# EAGLE design mailbox (EAGLE 7.5.0)
CNAME: MiniElektro Denmark; CREVISION: 0 #1616; DESIGNER: By: NWYKE
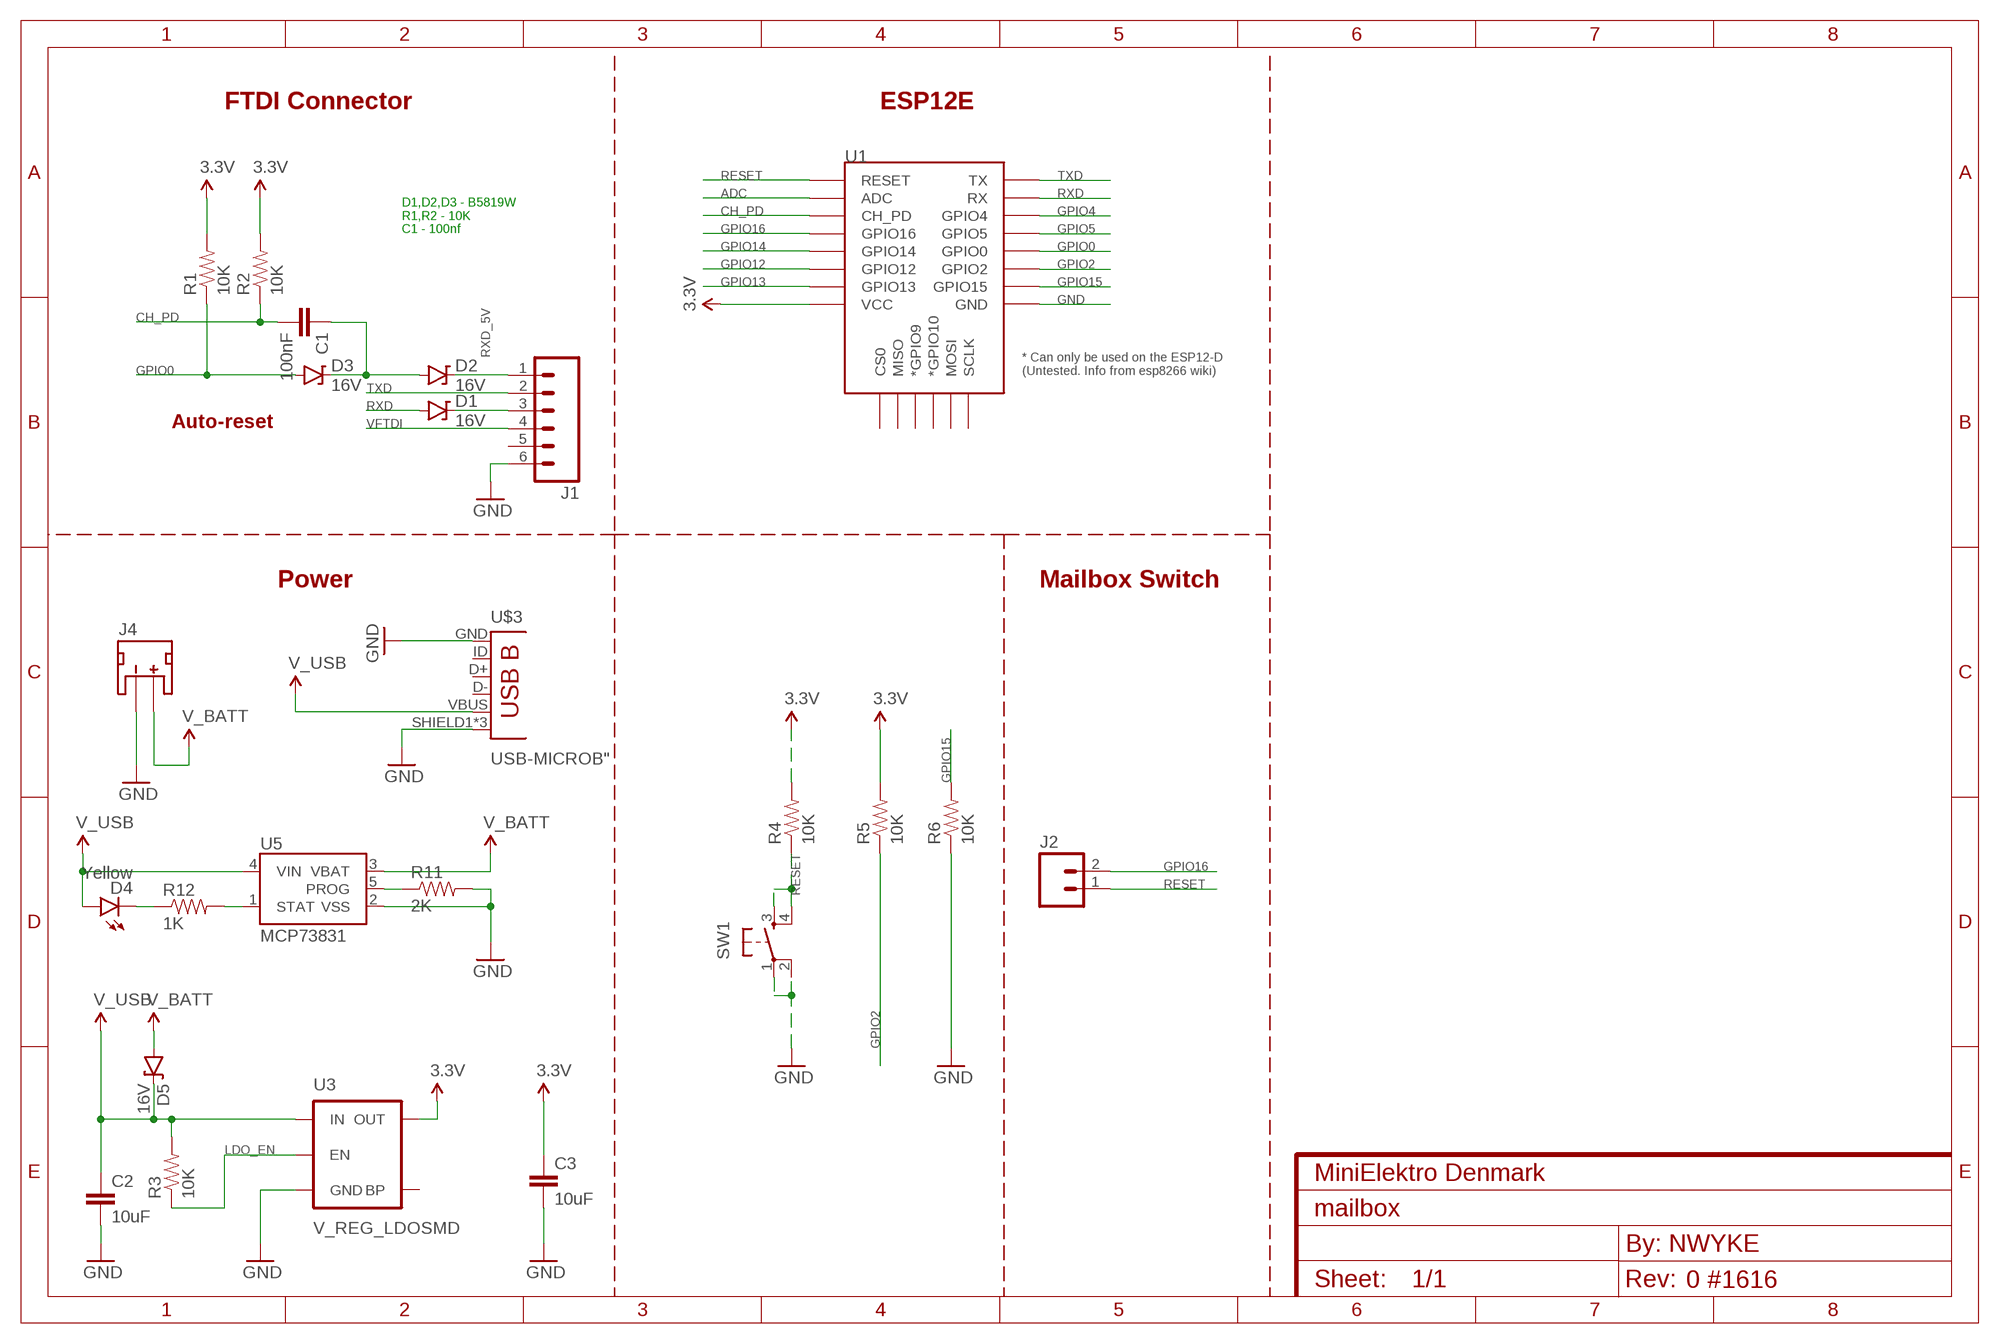
[diagram p0: schematic, sheet 1]

## Parts
C1  100nF  CAP0402-CAP  [0402-CAP]
C2  10uF  CAP0402-CAP  [0402-CAP]
C3  10uF  CAP0402-CAP  [0402-CAP]
D1  16V  DIODE-ZENER16V  [SOD-123]
D2  16V  DIODE-ZENER16V  [SOD-123]
D3  16V  DIODE-ZENER16V  [SOD-123]
D4  Yellow  LED-YELLOW0603  [LED-0603]
D5  16V  DIODE-ZENER16V  [SOD-123]
J1  M06SILK_FEMALE_PTH  [1X06]
J2  M02LOCK  [1X02_LOCK]
J4  JST_2MM_MALE  [JST-2-SMD]
R1  10K  RESISTOR0402-RES  [0402-RES]
R2  10K  RESISTOR0402-RES  [0402-RES]
R3  10K  RESISTOR0402-RES  [0402-RES]
R4  10K  RESISTOR0402-RES  [0402-RES]
R5  10K  RESISTOR0402-RES  [0402-RES]
R6  10K  RESISTOR0402-RES  [0402-RES]
R11  2K  RESISTOR0603-RES  [0603-RES]
R12  1K  RESISTOR0603-RES  [0603-RES]
SW1  SWITCH_SPST_4_PINRECT  [TACTILE_SWITCH_SMD_4.6X2.8MM]
U1  ESP12ESMD  [ESP12E-SMD]
U3  V_REG_LDOSMD  [SOT23-5]
U5  MCP73831  [SOT23-5]
U$3  USB-MICROB"  [USB-B-MICRO-SMD_V03]

## Nets
3.3V: C3.1 R1.2 R2.2 R4.2 R5.2 U1.VCC U3.5(OUT)
ADC: U1.ADC
CH_PD: C1.2 R2.1 U1.CH_PD
GND: C2.2 C3.2 J1.6 J4.1(-) R6.1 R11.2 SW1.1 SW1.2 U1.GND U3.2(GND) U5.2(VSS) U$3.GND U$3.SHIELD1(SHIELD) U$3.SHIELD2(SHIELD) U$3.SHIELD3(SHIELD)
GPIO0: D3.A R1.1 U1.GPIO0
GPIO2: R5.1 U1.GPIO2
GPIO4: U1.GPIO4
GPIO5: U1.GPIO5
GPIO12: U1.GPIO12
GPIO13: U1.GPIO13
GPIO14: U1.GPIO14
GPIO15: R6.2 U1.GPIO15
GPIO16: J2.2 U1.GPIO16
LDO_EN: R3.1 U3.3(EN)
N$1: D4.C R12.1
N$2: D2.C J1.1
N$3: C1.1 D2.A D3.C
N$6: R12.2 U5.1(STAT)
N$7: R11.1 U5.5(PROG)
RESET: J2.1 R4.1 SW1.3 SW1.4 U1.RESET
RXD: D1.A U1.RXD0(RX)
RXD_5V: D1.C J1.3
TXD: J1.2 U1.TXD0(TX)
V_BATT: D5.A J4.2(+) U5.3(VBAT)
V_USB: C2.1 D4.A D5.C R3.2 U3.1(IN) U5.4(VIN) U$3.VBUS
VFTDI: J1.4
Unconnected: J1.5 J4.NC1(PAD1) J4.NC2(PAD2) U1.CS0 U1.GPIO9(*GPIO9) U1.GPIO10(*GPIO10) U1.MISO U1.MOSI U1.SCLK U3.4(BP) U$3.D+ U$3.D- U$3.ID(USBID)

## Notes on the sheet
- FTDI Connector | ESP12E
- D1,D2,D3 - B5819W
  R1,R2 - 10K
  C1 - 100nf
- Auto-reset
- Power | Mailbox Switch

## Library data of the parts
C1-C3 = SparkFun-Passives:CAP: Capacitor Standard 0603 ceramic capacitor, and 0.1" leaded capacitor.
D1-D3 D5 = SparkFun-DiscreteSemi:DIODE-ZENER: Zener Diode Production Part - 8199 3.4V Zener Voltage; PROD_ID: DIO-12440
D4 = SparkFun-LED:LED-YELLOW: Yellow SMD LEDs LilyPad 1206- DIO-09909 0603- DIO-09003 "SMART" means more efficient and expensive; PROD_ID: DIO-09003
J1 = SparkFun-Connectors:M06: Header 6 Standard 6-pin 0.1" header. Use with straight break away headers (SKU : PRT-00116), right angle break away headers (PRT-00553), swiss pins (PRT-00743), machine pins (PRT-00117), and female headers (PRT-00115). Molex polarized connector foot print use with SKU : PRT-08094 with associated crimp pins and housings. NOTES ON THE VARIANTS LOCK and LOCK_LONGPADS... This footprint was designed to help hold the alignment of a through-hole component (i.e. 6-pin header) while soldering it into place. You may notice that each hole has been shifted either up or down by 0.005 of an inch from it's more standard position (which is a perfectly straight line). This slight alteration caused the pins (the squares in the middle) to touch the edges of the holes. Because they are alternating, it causes a "brace" to hold the component in place. 0.005 has proven to be the perfect amount of "off-center" position when using our standard breakaway headers. Although looks a little odd when you look at the bare footprint, once you have a header in there, the alteration is very hard to notice. Also,if you push a header all the way into place, it is covered up entirely on the bottom side. This idea of altering the position of holes to aid alignment will be further integrated into the Sparkfun Library for other footprints. It can help hold any component with 3 or more connection pins.; PROD_ID: CONN-08437
J2 = SparkFun-Connectors:M02: Standard 2-pin 0.1" header. Use with - straight break away headers ( PRT-00116) - right angle break away headers (PRT-00553) - swiss pins (PRT-00743) - machine pins (PRT-00117) - female headers (PRT-00115) Molex polarized connector foot print use with: PRT-08233 with associated crimp pins and housings. 2.54_SCREWTERM for use with PRT-10571. 3.5mm Screw Terminal footprints for PRT-08084 5mm Screw Terminal footprints for use with PRT-08432
J4 = SparkFun-Connectors:JST_2MM_MALE: Mates to single-cell LiPo batteries. CONN-11443 Now with smashable polarity marks!; BTM_NEG: -; BTM_POS: +; PROD_ID: CONN-11443; TOP_NEG: -; TOP_POS: +
R1-R6 R11 R12 = SparkFun-Passives:RESISTOR: Resistor Basic schematic elements and footprints for 0603, 1206, and PTH resistors.
SW1 = SparkFun-Electromechanical:SWITCH_SPST_4_PIN; PROD_ID: SWCH-13065
U1 = esp8266modules:ESP12E: ESP12E Module
U3 = SparkFun-PowerIC:V_REG_LDO: Voltage Regulator LDO Standard 150mA LDO voltage regulator in SOT-23 layout. Micrel part MIC5205. BP (by-pass) pin is used to lower output noise with 470pF cap.
U5 = SparkFun-PowerIC:MCP73831: Miniature single cell, fully integrated Li-Ion, Li-polymer charge management controller http://ww1.microchip.com/downloads/en/DeviceDoc/20001984g.pdf IC-09995; PROD_ID: IC-09995
U$3 = SparkFun-Connectors:USB-MICROB; PROD_ID: CONN-11752

## Board
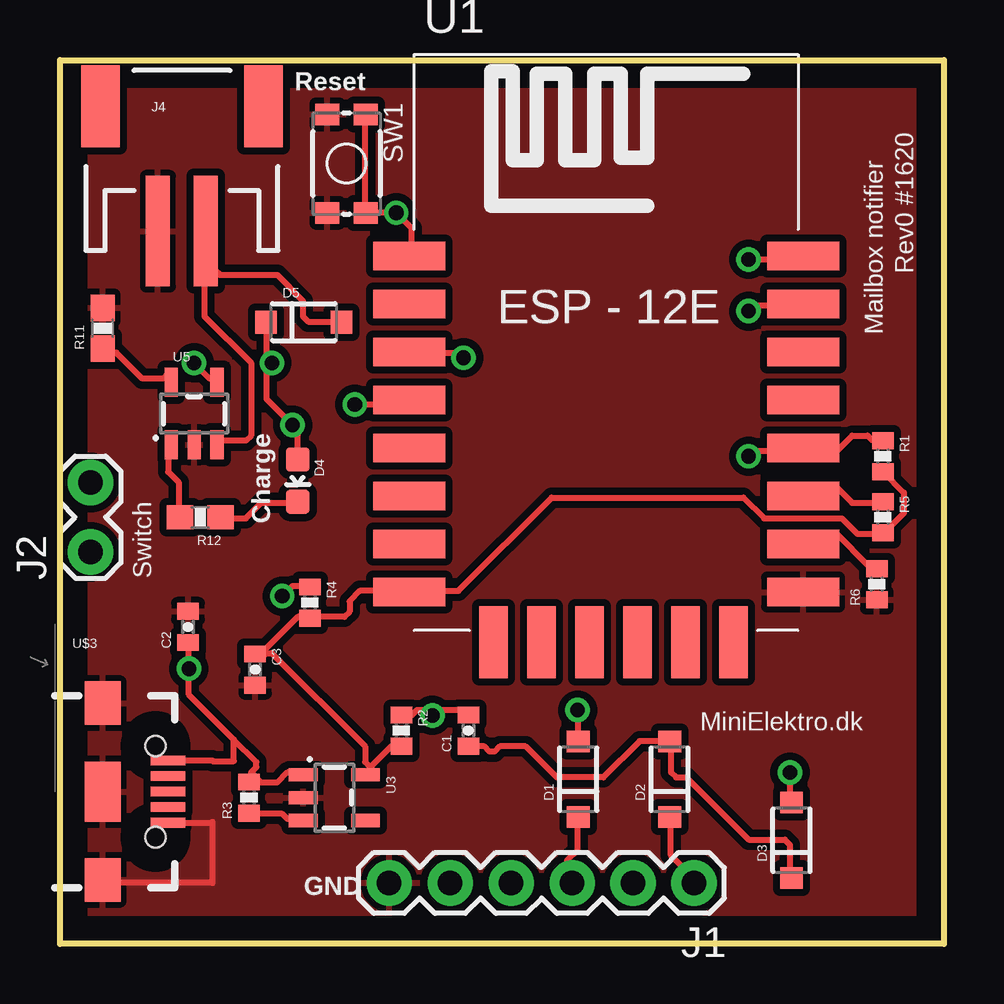
[diagram p1: board, top side]
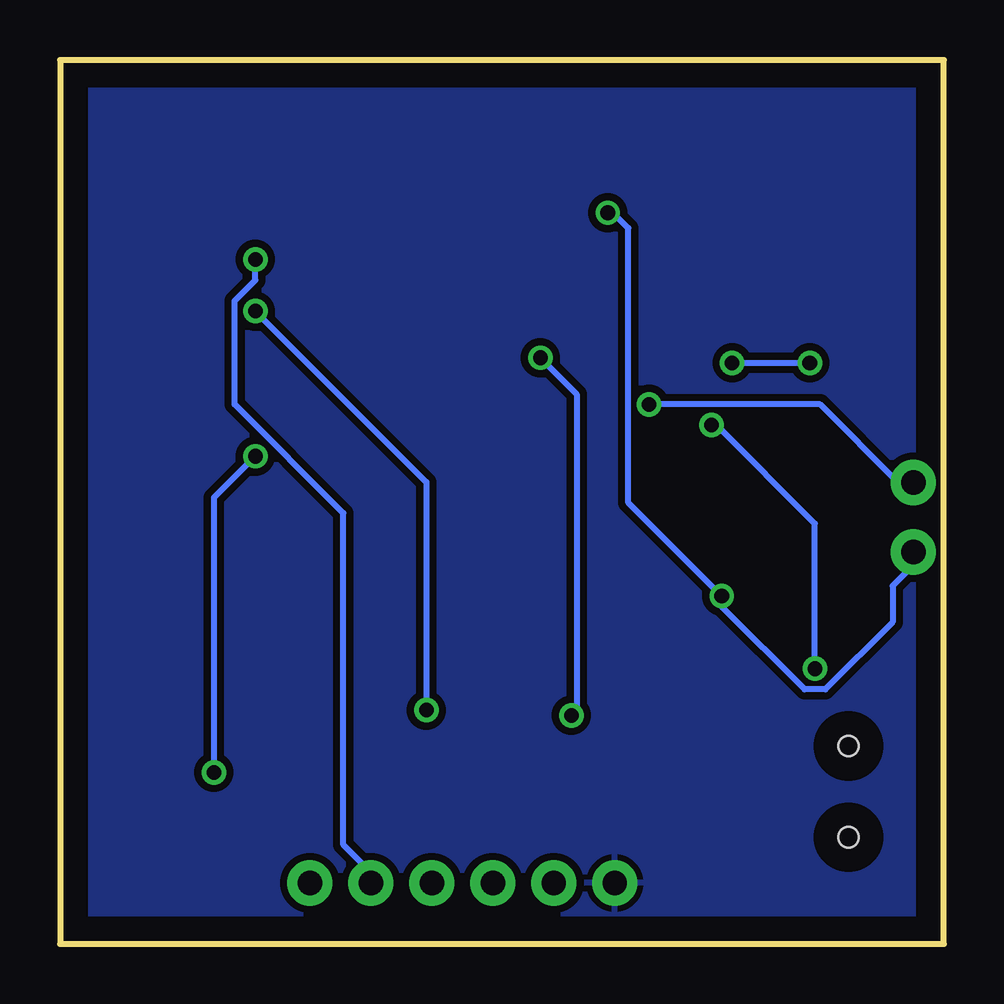
[diagram p2: board, bottom side, seen from below]

Size 36.83 x 36.83 mm. Coordinates in mm from the lower left corner, seen from the top.
Outline: 0,0 0,36.83 36.83,36.83 36.83,0 0,0
Copper layers (1*16): Top 0.035mm / dielectric 1.5mm / Bottom 0.035mm
Design rules "default *": minimum track width 10mil, minimum drill 24mil, track to track 7mil, track to pad 7mil, pad to pad 7mil, via to via 7mil, smd to smd 7mil, copper to edge 40mil, drill to drill 8mil, minimum pad ring 10mil, minimum via ring 8mil, stop-mask expansion 4mil, vias tented up to drill 0mil, thermal gap 10mil

### Footprints (pad centres in the part's own frame; a part is rotated, then mirrored left to right if it is on the bottom)
0402-CAP = smd 0.7 x 0.9: 1 -0.65,0; 2 0.65,0
SOD-123 = smd 0.9 x 0.95: A 1.575,0; C -1.575,0
LED-0603 = smd 1 x 1: A 0,-0.877; C 0,0.877
1X06 = drill 1.016 pad 1.88: 1 0,0; 2 2.54,0; 3 5.08,0; 4 7.62,0; 5 10.16,0; 6 12.7,0
1X02_LOCK = drill 1.016 pad 1.88: 1 -0.178,0; 2 2.718,0
JST-2-SMD = smd 1 x 4.6: 1 -1,-3.7; 2 1,-3.7 | smd 1.6 x 3.4: NC1 -3.4,1.5; NC2 3.4,1.5
0402-RES = smd 0.7 x 0.9: 1 -0.65,0; 2 0.65,0
0603-RES = smd 1.1 x 1: 1 -0.85,0; 2 0.85,0
TACTILE_SWITCH_SMD_4.6X2.8MM = smd 0.9 x 1: 1 -2.05,-0.8; 2 2.05,-0.8; 3 2.05,0.8; 4 -2.05,0.8
ESP12E-SMD = smd 3 x 1.2: ADC -8.3,3.8; CH_PD -8.3,1.8; GND 8.1,-8.2; GPIO0 8.1,-2.2; GPIO2 8.1,-4.2; GPIO4 8.1,1.8; GPIO5 8.1,-0.2; GPIO12 -8.3,-4.2; GPIO13 -8.3,-6.2; GPIO14 -8.3,-2.2; GPIO15 8.1,-6.2; GPIO16 -8.3,-0.2; RESET -8.3,5.8; RXD0 8.1,3.8; TXD0 8.1,5.8; VCC -8.3,-8.2 | smd 1.2 x 3: CS0 -4.8,-10.3; GPIO9 -0.8,-10.3; GPIO10 1.2,-10.3; MISO -2.8,-10.3; MOSI 3.2,-10.3; SCLK 5.2,-10.3
SOT23-5 = smd 0.55 x 1.2: 1 -0.95,-1.3; 2 0,-1.3; 3 0.95,-1.3; 4 0.95,1.3; 5 -0.95,1.3
USB-B-MICRO-SMD_V03 = smd 1.45 x 0.4: D+ 2.725,0; D- 2.725,0.65; GND 2.725,-1.3; ID 2.725,-0.65; VBUS 2.725,1.3 | smd 1.5 x 1.8: SHIELD1 0,3.685; SHIELD2 0,-3.685 | smd 1.5 x 2.5: SHIELD3 0,0 | hole 0.85: 2.2,1.9; 2.2,-1.9

### Placement (x,y rotation side)
C1  17.02,8.89 90 top
C2  5.33,13.21 90 top
C3  8.13,11.43 270 top
D1  21.59,6.86 90 top
D2  25.4,6.86 90 top
D3  30.48,4.32 90 top
D4  9.91,19.3 180 top
D5  10.16,25.91 0 top
J1  26.42,2.54 180 top
J2  1.27,16.51 90 top
J4  5.08,33.4 0 top
R1  34.29,20.32 270 top
R2  14.22,8.89 270 top
R3  7.87,6.1 90 top
R4  10.41,14.22 270 top
R5  34.29,17.78 270 top
R6  34.04,14.99 90 top
R11  1.78,25.65 90 top
R12  5.84,17.78 180 top
SW1  11.94,32.51 270 top
U1  22.86,22.86 0 top
U3  11.43,6.1 270 top
U5  5.59,22.1 0 top
U$3  1.78,6.35 0 top

### Tracks (layer width: path | path; a pad name or v marks a point on that pad's centre or on a via)
3.3V
  Top 0.254: 12.93,7.37 13.79,8.23 R2.2 | 12.93,7.37 13.14,7.15 12.93,6.93 U3.5 | 12.93,7.37 12.71,7.58 12.71,8.23 8.83,12.12 8.61,12.12 8.39,11.9 8.18,11.9 C3.1 8.18,12.12 8.39,12.12 9.91,13.63 10.34,13.63 R4.2 10.55,13.63 11.85,13.63 12.06,13.84 12.06,14.28 12.5,14.71 14.44,14.71 U1.VCC 14.66,14.71 16.6,14.71 20.48,18.59 28.47,18.59 29.34,17.73 32.58,17.73 33.22,17.08 34.09,17.08 R5.2 34.3,17.3 34.52,17.3 35.17,17.95 35.17,18.81 34.3,19.67 R1.2
CH_PD  (via drill 0.61)
  Top 0.254: R2.1 14.22,9.53 14.66,9.53 14.87,9.74 15.3,9.74 v15.52,9.53 15.73,9.53 15.95,9.74 16.82,9.74 C1.2 | v16.82,24.42 16.6,24.64 14.66,24.64 U1.CH_PD
  Bottom 0.254: v15.52,9.53 15.3,9.53 15.3,22.91 v16.82,24.42
GND
  Top 0.254: U$3.GND 6.35,5.05 | 6.35,5.05 6.35,5.08 | 6.35,5.05 6.35,2.54 1.78,2.54 U$3.SHIELD2
  pour Bottom (isolate 0.305): 0,36.83 0,0 36.83,0 36.83,36.83
  pour Top (isolate 0.305): 0,36.83 0,0 36.83,0 36.83,36.83
GPIO0  (via drill 0.61)
  Top 0.254: R1.1 34.09,20.97 33.87,20.97 33.66,21.18 33.01,21.18 32.36,20.54 31.06,20.54 U1.GPIO0 30.85,20.54 28.91,20.54 v28.69,20.32 | v30.42,7.15 30.42,6.07 D3.A
  Bottom 0.254: v30.42,7.15 30.42,18.59 v28.69,20.32
GPIO2
  Top 0.254: R5.1 34.09,18.38 33.01,18.38 32.36,19.03 31.28,19.03 31.06,18.81 U1.GPIO2
GPIO15
  Top 0.254: R6.2 33.87,15.79 33.66,15.79 32.36,17.08 31.28,17.08 31.06,16.87 U1.GPIO15
GPIO16  (via drill 0.61)
  Top 0.254: v12.28,22.48 14.44,22.48 U1.GPIO16
  Bottom 0.254: v12.28,22.48 5.16,22.48 1.92,19.24 J2.2
LDO_EN
  Top 0.254: R3.1 7.96,5.42 9.26,5.42 9.47,5.21 10.12,5.21 U3.3
N$1
  Top 0.254: D4.C 9.91,18.38 8.39,18.38 7.75,17.73 6.88,17.73 R12.1
N$2
  Top 0.254: D2.C 25.45,5.21 25.45,3.7 26.53,2.62 J1.1
N$3
  Top 0.254: 25.45,8.45 25.23,8.66 25.02,8.45 24.16,8.45 22.64,6.93 20.7,6.93 19.41,8.23 18.33,8.23 18.11,8.01 17.89,8.01 17.68,8.23 C1.1 | 25.45,8.45 25.67,8.23 25.45,8.01 25.45,7.15 25.67,6.93 26.1,6.93 28.69,4.34 30.2,4.34 30.42,4.13 30.42,2.83 D3.C | 25.45,8.45 D2.A
N$6
  Top 0.254: R12.2 4.94,17.95 4.94,19.24 4.51,19.67 4.51,20.75 U5.1
N$7
  Top 0.254: R11.1 1.92,24.64 2.35,24.64 3.43,23.56 4.29,23.56 4.51,23.77 4.72,23.56 U5.5
RESET  (via drill 0.61)
  Top 0.254: U1.RESET 14.66,28.74 14.66,29.82 v14.01,30.47 12.93,30.47 SW1.3 12.71,30.47 12.71,34.35 SW1.4 | v9.26,14.49 9.69,14.92 10.34,14.92 R4.1
  Bottom 0.254: J2.1 1.27,15.79 2.13,14.92 2.13,13.41 4.94,10.6 5.8,10.6 9.26,14.06 v9.26,14.49 13.14,18.38 13.14,29.82 13.79,30.47 v14.01,30.47
RXD  (via drill 0.61)
  Top 0.254: v21.57,9.74 21.57,8.45 D1.A | v28.69,26.37 28.91,26.58 30.85,26.58 U1.RXD0
  Bottom 0.254: v21.57,9.74 21.57,19.24 v28.69,26.37
RXD_5V
  Top 0.254: D1.C 21.57,5.21 21.57,3.91 21.13,3.48 21.13,2.62 J1.3
TXD  (via drill 0.61)
  Top 0.254: v28.69,28.52 30.85,28.52 U1.TXD0
  Bottom 0.254: v28.69,28.52 28.69,27.66 29.55,26.8 29.55,22.48 25.02,17.95 25.02,4.13 23.94,3.05 23.94,2.62 J1.2
V_BATT
  Top 0.254: 6.45,28.09 6.24,28.31 6.24,29.6 J4.2 6.45,28.09 | 6.45,28.09 6.67,27.88 9.04,27.88 10.12,26.8 10.12,26.15 10.34,25.93 11.63,25.93 D5.A | 6.45,28.09 6.02,27.66 6.02,26.15 7.96,24.21 7.96,21.18 7.75,20.97 6.67,20.97 U5.3
V_USB  (via drill 0.61)
  Top 0.254: 8.61,24.21 8.61,22.7 v9.69,21.62 9.91,21.4 D4.A | 8.61,24.21 8.61,25.72 D5.C | v5.59,24.21 6.24,23.56 6.45,23.56 U5.4 | 8.61,24.21 v8.83,24.21 | 8.39,6.72 9.04,6.72 9.47,7.15 10.12,7.15 U3.1 | 8.39,6.72 7.96,6.72 R3.2 | 7.24,8.52 8.18,7.58 8.18,7.37 7.96,7.15 8.39,6.72 | 7.24,8.52 5.37,10.39 v5.37,11.47 5.37,12.55 C2.1 | U$3.VBUS 6.35,7.65 6.35,7.62 7.24,7.62 7.24,8.52
  Bottom 0.254: v8.83,24.21 v5.59,24.21 | v9.69,21.62 9.47,21.62 5.37,17.51 v5.37,11.47

### Text on the board
tPlace: Reset | Rev0 #1620 | Mailbox notifier | Charge | Switch | MiniElektro.dk | GND